# EasyEDA Pro project DualModeKeyboard.eprj

# Schematic Schematic1
Create Date: 2023-08-28; Page Name: P1; Project Name: DualModeKeyboard; Schematic Name: Schematic1; Update Date: 2023-08-28; Company: xChenNing; Drawed: xChenNing; Page Size: A4; Reviewed: xChenNing; Version: V1.0
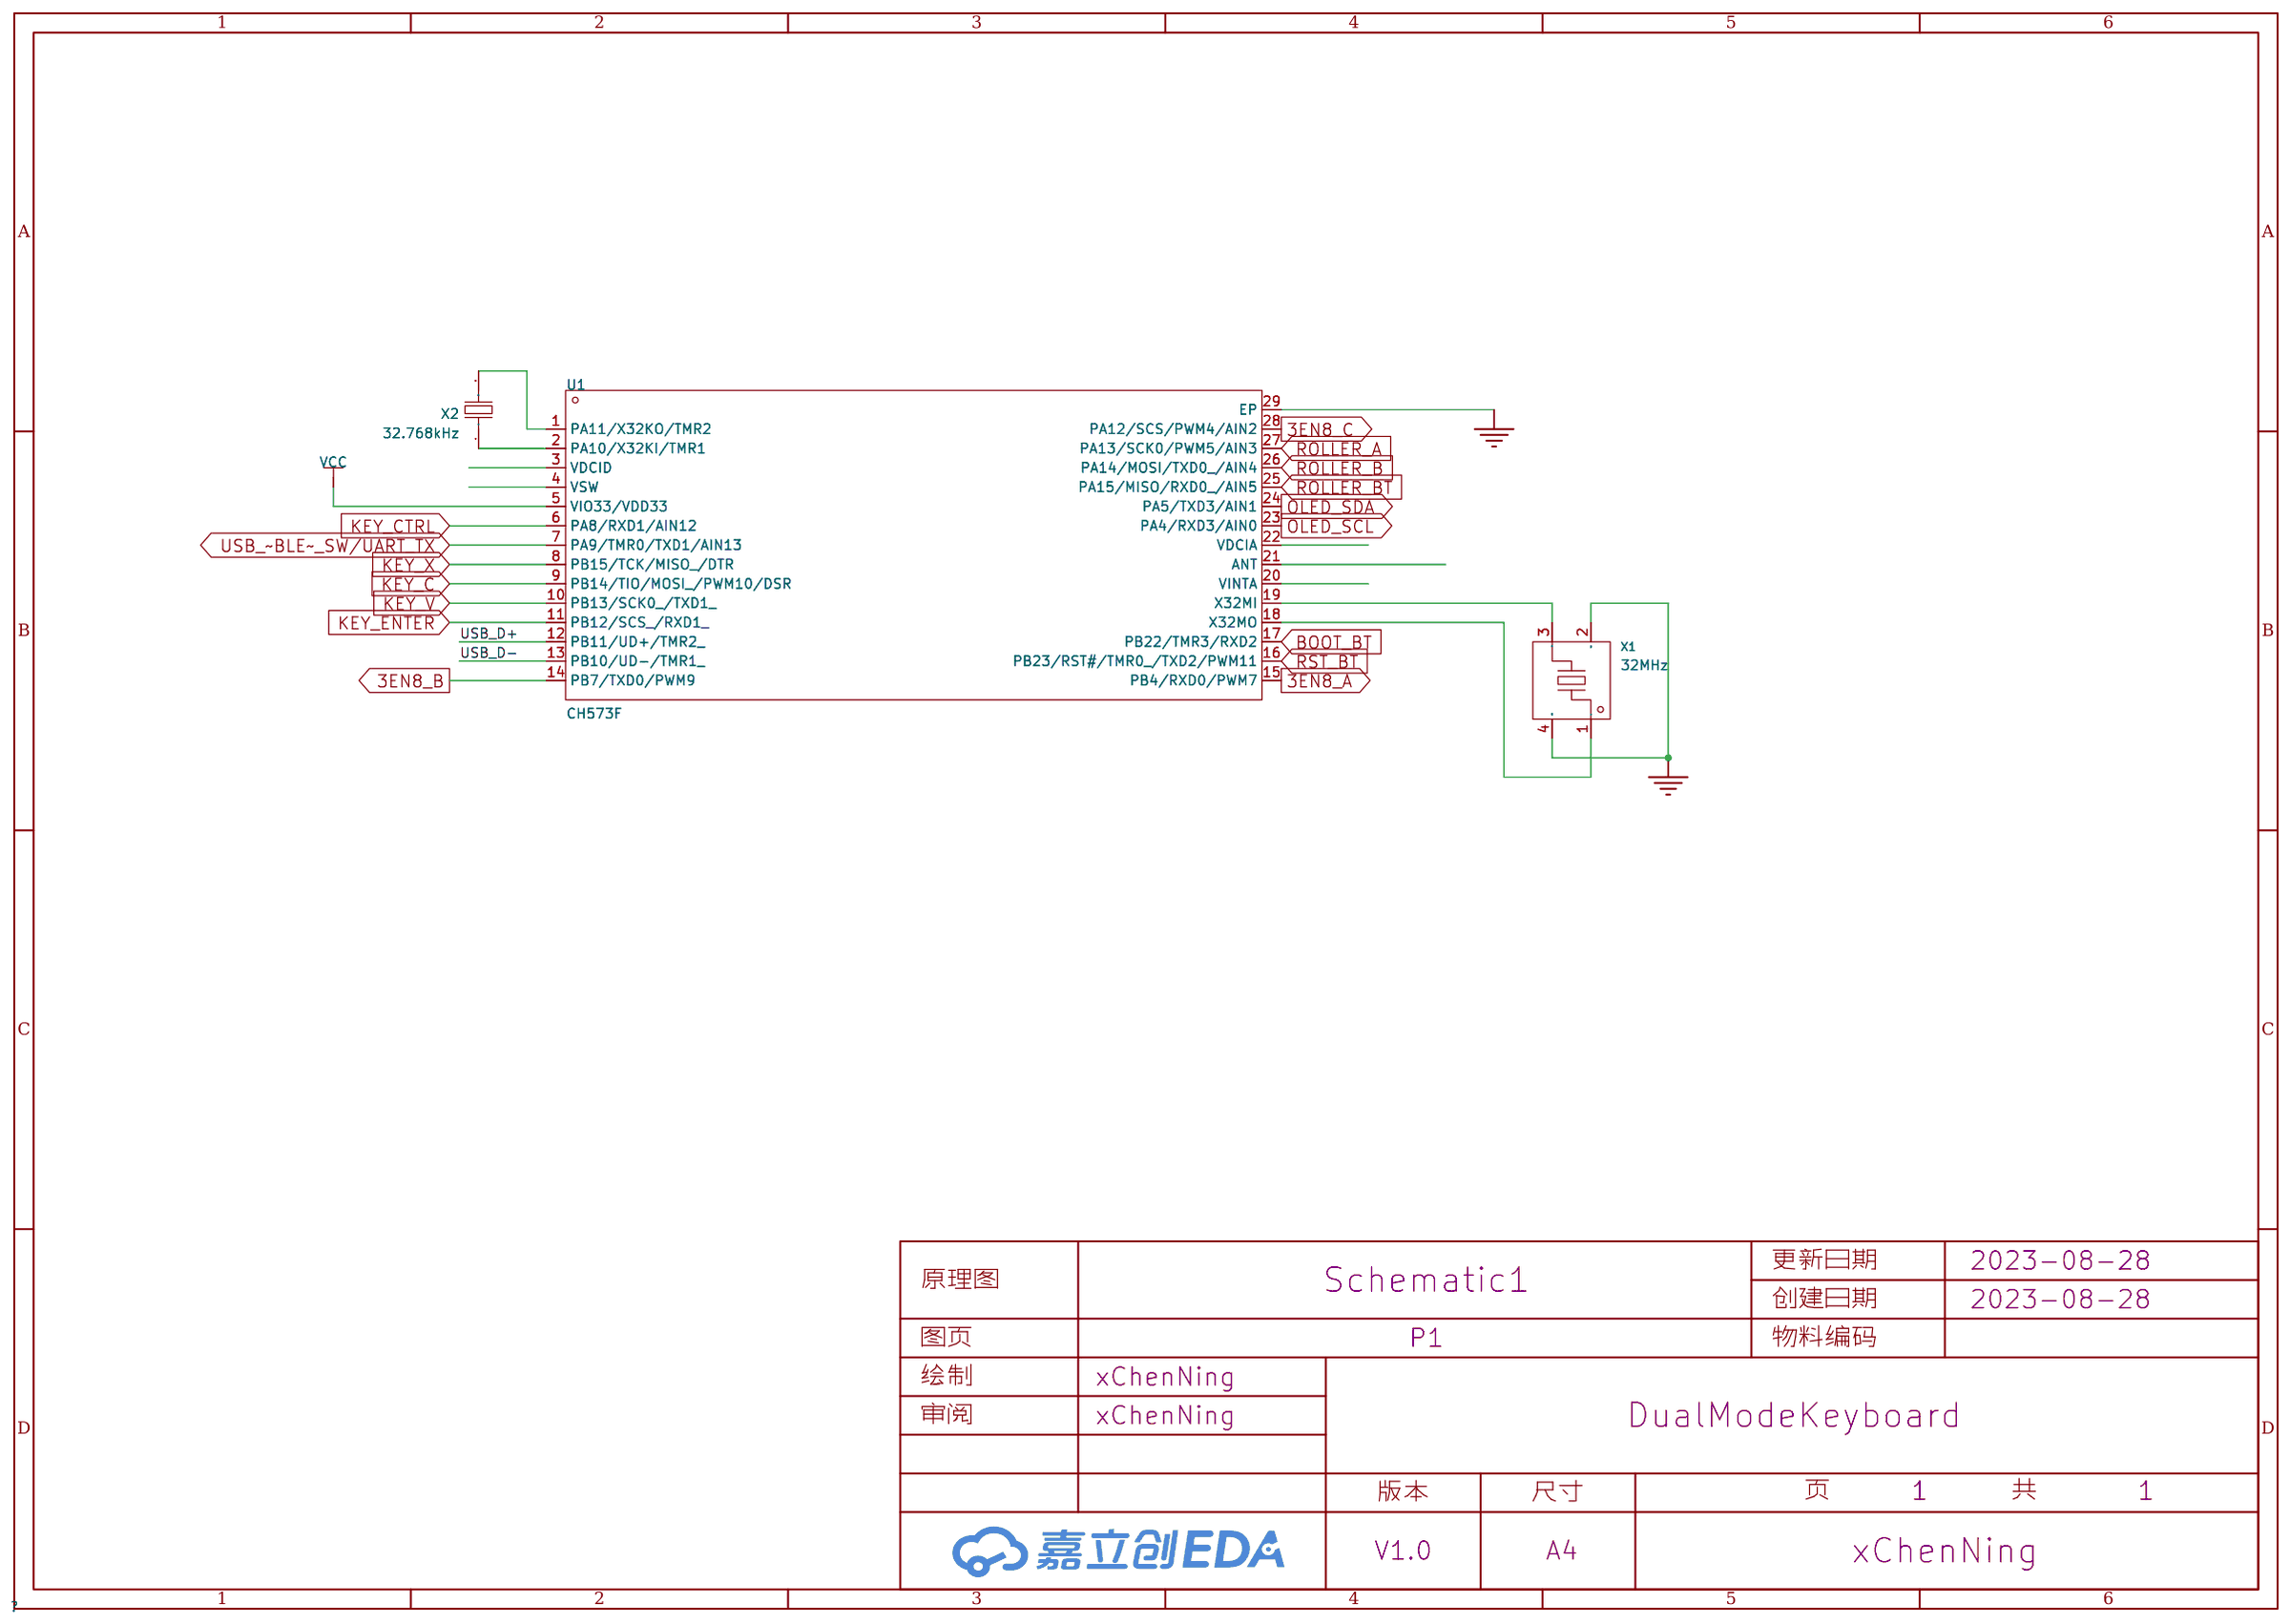
[diagram p0: schematic sheet]

## Parts
U1  CH573F  [QFN-28_L4.0-W4.0-P0.40-BL-EP]
X1  32MHz  [CRYSTAL-SMD_4P-L2.0-W1.6-BL]
X2  32.768kHz  [FC-135R_L3.2-W1.5]

## Library data of the parts
U1 = CH573F: Supplier Part: C2830434; Supplier Footprint: QFN-28; JLCPCB Part Class: 扩展库; Datasheet: https://atta.szlcsc.com/upload/public/pdf/source/20211009/C2830434_9B1CC9FF0455758F5FF7F545AE5FEE38.pdf; Supplier: LCSC
X1 = Q22FA1280002500: 频率:32MHz;频率公差:±10ppm;负载电容:8pF;; LCSC Part Name: 32MHz ±10ppm 8pF; Supplier Part: C187794; Manufacturer: EPSON(爱普生); Supplier Footprint: SMD2016-4P; JLCPCB Part Class: 扩展库; Datasheet: https://atta.szlcsc.com/upload/public/pdf/source/20180308/C187794_15204923326641414211.pdf; Supplier: LCSC; Crystal Type: 贴片无源晶振; Frequency Tolerance: ±10ppm; Load Capacitance: 8pF; Equivalent Series Resistance (ESR): 60Ω; Operating Temperature: -40℃~+85℃
X2 = Q13FC1350000400: 频率:32.768kHz;频率公差:±20ppm;负载电容:12.5pF;; LCSC Part Name: 32.768kHz ±20ppm 12.5pF; Supplier Part: C32346; Manufacturer: EPSON(爱普生); Supplier Footprint: SMD3215-2P; JLCPCB Part Class: 基础库; Datasheet: https://atta.szlcsc.com/upload/public/pdf/source/20190108/C32346_746D6B07EAF90824457A96480007685F.pdf; Supplier: LCSC; Crystal Type: 贴片无源晶振; Frequency Tolerance: ±20ppm; Load Capacitance: 12.5pF; Equivalent Series Resistance (ESR): 70kΩ; Operating Temperature: -40℃~+85℃

## Nets
GND: U1.29(EP) X1.2(GND) X1.4(GND)
VCC: U1.5(VIO33/VDD33)
3EN8_A: U1.15(PB4/RXD0/PWM7)
3EN8_B: U1.14(PB7/TXD0/PWM9)
3EN8_C: U1.28(PA12/SCS/PWM4/AIN2)
BOOT_BT: U1.17(PB22/TMR3/RXD2)
KEY_C: U1.9(PB14/TIO/MOSI_/PWM10/DSR)
KEY_CTRL: U1.6(PA8/RXD1/AIN12)
KEY_ENTER: U1.11(PB12/SCS_/RXD1_)
KEY_V: U1.10(PB13/SCK0_/TXD1_)
KEY_X: U1.8(PB15/TCK/MISO_/DTR)
OLED_SCL: U1.23(PA4/RXD3/AIN0)
OLED_SDA: U1.24(PA5/TXD3/AIN1)
ROLLER_A: U1.27(PA13/SCK0/PWM5/AIN3)
ROLLER_B: U1.26(PA14/MOSI/TXD0_/AIN4)
ROLLER_BT: U1.25(PA15/MISO/RXD0_/AIN5)
RST_BT: U1.16(PB23/RST#/TMR0_/TXD2/PWM11)
USB_D+: U1.12(PB11/UD+/TMR2_)
USB_D-: U1.13(PB10/UD-/TMR1_)
USB_~BLE~_SW/UART_TX: U1.7(PA9/TMR0/TXD1/AIN13)
Net-(U1-1): U1.1(PA11/X32KO/TMR2) X2.2
Net-(U1-2): U1.2(PA10/X32KI/TMR1) X2.1
Net-(U1-18): U1.18(X32MO) X1.1
Net-(U1-19): U1.19(X32MI) X1.3

Not connected (* = marked no-connect by the designer): U1 3(VDCID) 4(VSW) 20(VINTA) 21(ANT) 22(VDCIA)
